# Altium schematic sheet top_blank.SchDoc
size 381 x 241 mm; SheetNumber: 1; SheetTotal: 9
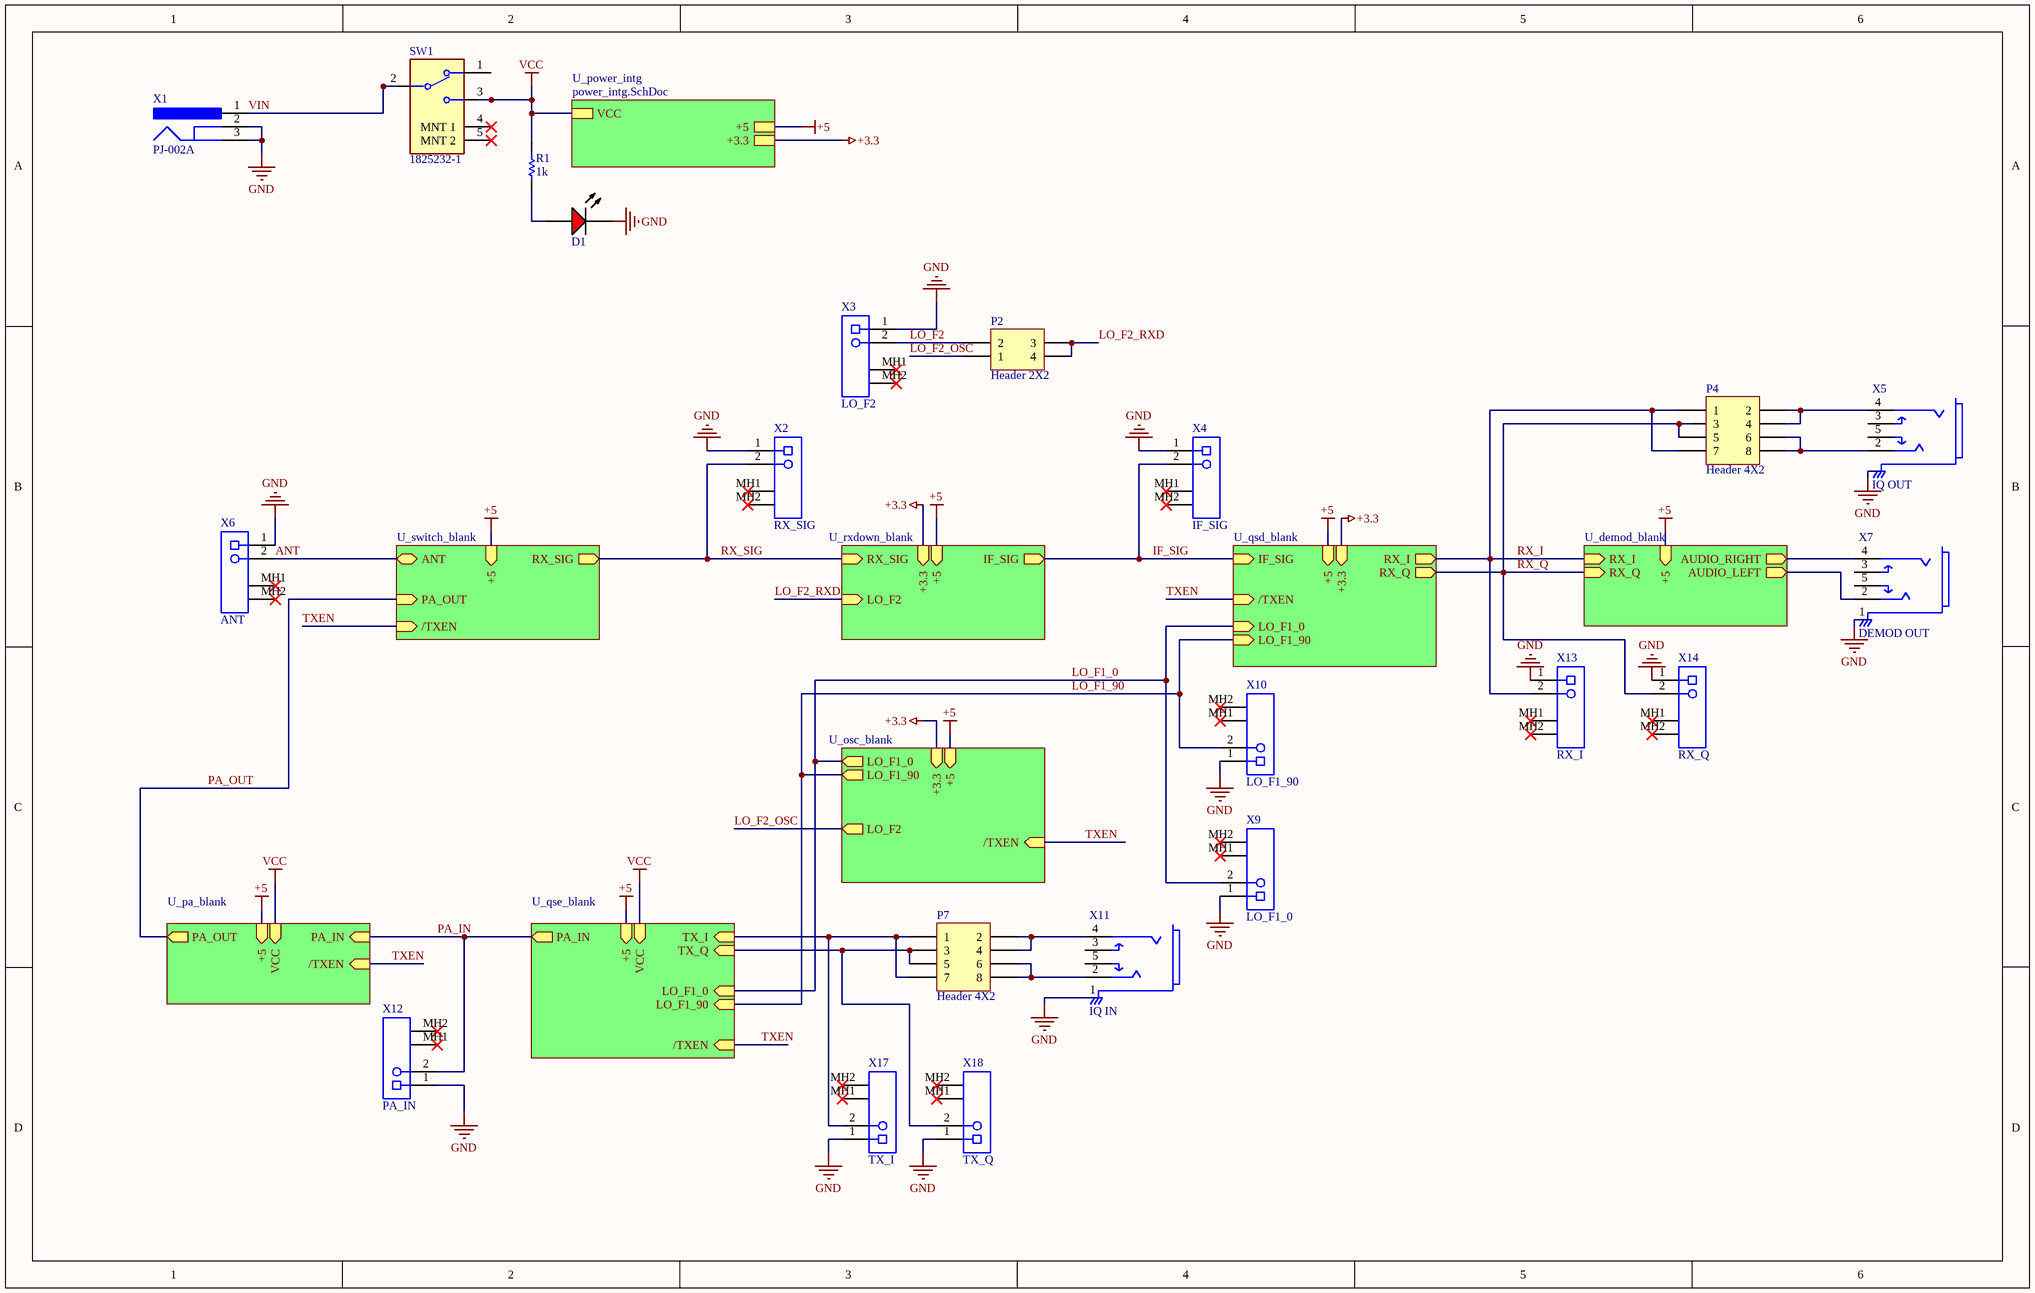
[diagram p0: top_blank.SchDoc]

## Parts
D1  HLMP-3301  [AVAG-HLMP-3301-2]  (value not drawn)
P2  Header 2X2  [HDR2X2]
P4  Header 4X2  [HDR2X4]
P7  Header 4X2  [HDR2X4]
R1  value 1k  [AXIAL-0.4]  (hidden comment: Res1)
SW1  1825232-1  [FP-1825232-1-MFG]
X1  PJ-002A  [CUI-PJ-002A_V]
X2  RX_SIG  [TECO-1-1337543-0_V]
X3  LO_F2  [TECO-1-1337543-0_V]
X4  IF_SIG  [TECO-1-1337543-0_V]
X5  IQ OUT  [FP-35RAPC4BV4-MFG]
X6  ANT  [TECO-1-1337543-0_V]
X7  DEMOD OUT  [FP-35RAPC4BV4-MFG]
X9  LO_F1_0  [TECO-1-1337543-0_V]
X10  LO_F1_90  [TECO-1-1337543-0_V]
X11  IQ IN  [FP-35RAPC4BV4-MFG]
X12  PA_IN  [TECO-1-1337543-0_V]
X13  RX_I  [TECO-1-1337543-0_V]
X14  RX_Q  [TECO-1-1337543-0_V]
X17  TX_I  [TECO-1-1337543-0_V]
X18  TX_Q  [TECO-1-1337543-0_V]

## Sub-sheets
U_demod_blank = demod_blank.SchDoc: AUDIO_LEFT (out), AUDIO_RIGHT (out), +5 (in), RX_Q (in), RX_I (in)
U_osc_blank = osc_blank.SchDoc: /TXEN (in), LO_F1_0 (out), LO_F1_90 (out), LO_F2 (out), +5 (in), +3.3 (in)
U_pa_blank = pa_blank.SchDoc: PA_IN (in), PA_OUT (out), /TXEN (in), +5 (in), VCC (in)
U_power_intg = power_intg.SchDoc: VCC, +3.3, +5
U_qsd_blank = qsd_blank.SchDoc: RX_I (out), RX_Q (out), IF_SIG (in), /TXEN (in), LO_F1_90 (in), LO_F1_0 (in), +5 (in), +3.3 (in)
U_qse_blank = qse_blank.SchDoc: TX_I (in), TX_Q (in), /TXEN (in), LO_F1_0 (in), LO_F1_90 (in), PA_IN (out), VCC (in), +5 (in)
U_rxdown_blank = rxdown_blank.SchDoc: IF_SIG (out), +5 (in), +3.3 (in), LO_F2 (in), RX_SIG (in)
U_switch_blank = switch_blank.SchDoc: ANT (bidir), RX_SIG (out), PA_OUT (in), /TXEN (in), +5 (in)

## Nets
+3.3: sheet U_rxdown_blank/+3.3, sheet U_qsd_blank/+3.3, sheet U_osc_blank/+3.3, sheet U_power_intg/+3.3
+5: sheet U_switch_blank/+5, sheet U_rxdown_blank/+5, sheet U_qsd_blank/+5, sheet U_demod_blank/+5, sheet U_osc_blank/+5, sheet U_pa_blank/+5, sheet U_qse_blank/+5, sheet U_power_intg/+5
GND: D1.1(K) X1.2 X1.3 X2.1 X3.1 X4.1 X5.1 X6.1 X7.1 X9.1 X10.1 X11.1 X12.1 X13.1 X14.1 X17.1 X18.1
VCC: R1.2 SW1.3 ; sheet U_pa_blank/VCC, sheet U_qse_blank/VCC, sheet U_power_intg/VCC
ANT: X6.2 ; sheet U_switch_blank/ANT
IF_SIG: X4.2 ; sheet U_rxdown_blank/IF_SIG, sheet U_qsd_blank/IF_SIG
LO_F1_0: X9.2 ; sheet U_qsd_blank/LO_F1_0, sheet U_osc_blank/LO_F1_0, sheet U_qse_blank/LO_F1_0
LO_F1_90: X10.2 ; sheet U_qsd_blank/LO_F1_90, sheet U_osc_blank/LO_F1_90, sheet U_qse_blank/LO_F1_90
LO_F2: P2.2 X3.2
LO_F2_OSC: P2.1 ; sheet U_osc_blank/LO_F2
LO_F2_RXD: P2.3 P2.4 ; sheet U_rxdown_blank/LO_F2
PA_IN: X12.2 ; sheet U_pa_blank/PA_IN, sheet U_qse_blank/PA_IN
PA_OUT: sheet U_switch_blank/PA_OUT, sheet U_pa_blank/PA_OUT
RX_I: P4.1 P4.7 X13.2 ; sheet U_qsd_blank/RX_I, sheet U_demod_blank/RX_I
RX_Q: P4.3 P4.5 X14.2 ; sheet U_qsd_blank/RX_Q, sheet U_demod_blank/RX_Q
RX_SIG: X2.2 ; sheet U_switch_blank/RX_SIG, sheet U_rxdown_blank/RX_SIG
TXEN: sheet U_switch_blank//TXEN, sheet U_qsd_blank//TXEN, sheet U_osc_blank//TXEN, sheet U_pa_blank//TXEN, sheet U_qse_blank//TXEN
VIN: SW1.2 X1.1
NetD1_2: D1.2(A) R1.1
NetP4_2: P4.2 P4.4 X5.4
NetP4_6: P4.6 P4.8 X5.2
NetP7_1: P7.1 P7.7 X17.2 ; sheet U_qse_blank/TX_I
NetP7_2: P7.2 P7.4 X11.4
NetP7_3: P7.3 P7.5 X18.2 ; sheet U_qse_blank/TX_Q
NetP7_6: P7.6 P7.8 X11.2
NetX7_2: X7.2 ; sheet U_demod_blank/AUDIO_LEFT
NetX7_4: X7.4 ; sheet U_demod_blank/AUDIO_RIGHT

Not connected (* = marked no-connect by the designer): SW1 1 4(MNT_1)* 5(MNT_2)*; X2 MH1* MH2*; X3 MH1* MH2*; X4 MH1* MH2*; X5 3 5; X6 MH1* MH2*; X7 3 5; X9 MH1* MH2*; X10 MH1* MH2*; X11 3 5; X12 MH1* MH2*; X13 MH1* MH2*; X14 MH1* MH2*; X17 MH1* MH2*; X18 MH1* MH2*

## Library data of the parts
D1 = CMP-2000-06411-1: T-1 3/4 (5 mm) Diffused LED Lamp, 1.9 V, -40 to 100 degC, 2-Pin THD, RoHS, Bulk; Manufacturer: Avago; Forward Current: 25mA; Forward Voltage: 2.4V; Peak Wavelength: 635nm; Shape Type: Circular; High Brightness: No; Main Category: StandardLED; Test Current (It): 10mA; Dominant Wave Length: 626nm; Number of  Elements: 1; Reverse Voltage: 5V; Chip Material: GaP; Product Height (mm): 9.19mm; Lens Type: ColoredDiffused; Viewing Angle: 60deg; Type: Uni-Color; Emitting Color: Red; Luminous Intensity: 5.4mcd; Power Dissipation: 85W; DELETED: Compliant; Product Depth (mm): 6.1mm; Package Description: 2-Pin Through Hole LED, Dia 5.85 mm; Mounting Technology: ThroughHole; Manufacturer URL: http://www.avagotech.com/; Package Type: T-13/4; Operating Temp Range: -40Cto100C; Datasheet URL: http://www.avagotech.com/docs/AV02-1558EN; Mounting: ThroughHole; Lens Dimensions: 5.08x5.08x8.3mm; Package Reference: HLMP-3301; Datasheet Version: 03/2015; Pin Count: 2; Packaging: TapeandReel; Operating Temperature Classification: Industrial; Lum Intensity: 5.4mcd; Rad Hardened: No; Product Length (mm): 6.1mm
P2 = Header 2X2: Header, 2-Pin, Dual row; LatestRevisionDate: 17-Jul-2002; LatestRevisionNote: Re-released for DXP Platform.; Publisher: Altium Limited
P4 P7 = Header 4X2: Header, 4-Pin, Dual row; LatestRevisionDate: 17-Jul-2002; LatestRevisionNote: Re-released for DXP Platform.; Publisher: Altium Limited
R1 = Res1: Resistor; Published: 8-Jun-2000; LatestRevisionDate: 17-Jul-2002; LatestRevisionNote: Re-released for DXP Platform.; PackageReference: AXIAL-0.3; Publisher: Altium Limited; PackageDescription: Axial Device, Thru-Hole; 2 Leads; 0.3 in Pin Spacing
SW1 = CMP-03405-000001-1: SWITCH SLIDE SPDT 200MA 30V; Manufacturer: TE Connectivity; Contact Current Rating: 0.2A; Contact Resistance: 20mΩ; Electromechanical Life: 10000Cycles; Operating Force: 200gf; Throw Configuration: SPDT; Manufacturer Part Number: 1825232-1; Temperature Range High: +70°C; Height: 3.7mm; ComponentLink2URL: https://www.te.com/commerce/DocumentDelivery/DDEController?Action=showdoc&DocId=Customer+Drawing%7F1825232%7FB2%7Fpdf%7FEnglish%7FENG_CD_1825232_B2.pdf%7F1825232-1; Mount: Through Hole; Mouser Description: Slide Switches SLIDE SWITCH SPDT Right Angle; Package: 1825232-1; Temperature: -20°C to +70°C; Automotive: No; ComponentLink2Description: Datasheet; Lead Free: Yes; Octopart: https://octopart.com/1825232-1-te+connectivity-45209882; Device Class L1: Electromechanical; Digikey Description: SWITCH SLIDE SPDT 200MA 30V; Device Class L3: Slide Switches; Device Class L2: Switches; Voltage Rating Dc: 30V; Temperature Range Low: -20°C; Category: Switch; RoHS: TRUE
X1 = CMP-2000-06895-1: Through Hole Right Angle DC Power Jack, 2.5 A, 2 mm Center Pin, 3 Position, -25 to 85 degC, RoHS, Bulk; Manufacturer: CUIInc.; Current Rating: 2.5A; Inside Contact Diameter: 2mm; Insulation Resistance: 50MOhms; Outside Contact Diameter: 6.5mm; Voltage Rating: 24V; Brand: CUI; Operating Temperature Range: -25Cto+85C; Mounting Technology: ThroughHole; Connector Type: DCPowerJack; Contact Material: Copper; Datasheet URL: http://www.cui.com/product/resource/pj-002a.pdf; Contact Gender: Male; Housing Material: PolybutyleneTerephthalate(PBT); Manufacturer URL: http://www.cui.com/; Package Reference: PJ-002A; Mounting Style: ThroughHole; Mounting Angle: Right; Product Category: DCPowerConnectors; Product: Jacks; Flammability Rating: UL94V-0; Contact Plating: Nickel; RoHS: True; Datasheet Version: Rev. 1.03, 04/2016; Package Description: 3-Pin Through Hole Device, Body 14.4 x 9 mm, Height 11 mm; Factory Pack Quantity: 500; Termination Style: ThroughHole
X2-X4 X6 X9 X10 X12-X14 X17 X18 = CMP-2000-05853-1: Female Connector, Pitch 2.54 mm, 1 x 2 Position, Height 15.8 mm, Tail Length 3.8 mm, / -55 to 85 degC, RoHS, Bulk; Manufacturer: TE Connectivity; Connector Body Style: RightAngleJack; Frequency Max: 4GHz; Coaxial Termination: Solder; Connector Mounting: PCBMount; SVHC: ToBeAdvised; Connector Type: BNCCoaxial; Impedance: 50ohm; Coaxial Cable Types: -; Manufacturer URL: http://www.te.com/; Package Reference: 1-1337543-0; Product Range: -; Datasheet URL: http://www.te.com/commerce/DocumentDelivery/DDEController?Action=showdoc&DocId=Customer+Drawing%7F1337543%7FG%7Fpdf%7FEnglish%7FENG_CD_1337543_G.pdf%7F1-1337543-0; Contact Plating: GoldPlatedContacts; Mounting Technology: ThroughHole; Package Description: Female Connector, Pitch 2.54 mm, 1 x 2 Position, Height 15.8 mm, Tail Length 3.8 mm; Contact Material: Brass; Datasheet Version: Rev. G, 12/2012
X5 X7 X11 = CMP-47983-000001-1: CONN JACK STEREO 3.5MM R/A; Manufacturer: Switchcraft; Obsolete Part: true; Manufacturer Part Number: 35RAPC4BV4; Conn Orientation: Right Angle; Number Of Contacts: 5; Contact Material: Silver; Device Class L1: Connectors; Height: 0.495inch; ComponentLink2URL: http://www.switchcraft.com/Drawings/35rapc__v4_cd.pdf; Category: Conn; Digikey Description: CONN JACK STEREO 3.5MM R/A; Automotive: No; ComponentLink2Description: Datasheet; Package: 35RAPC4BV4; Device Class L2: Audio / Video Connectors; Mouser Description: Phone Connectors 3.5MM VERT STEREO JK; RoHS: TRUE; Octopart: https://octopart.com/35rapc4bv4-switchcraft-223606; Lead Free: Yes; Device Class L3: unset